# Altium schematic sheet R45_Driver.SchDoc
size A3; SheetNumber: 1; SheetTotal: 2
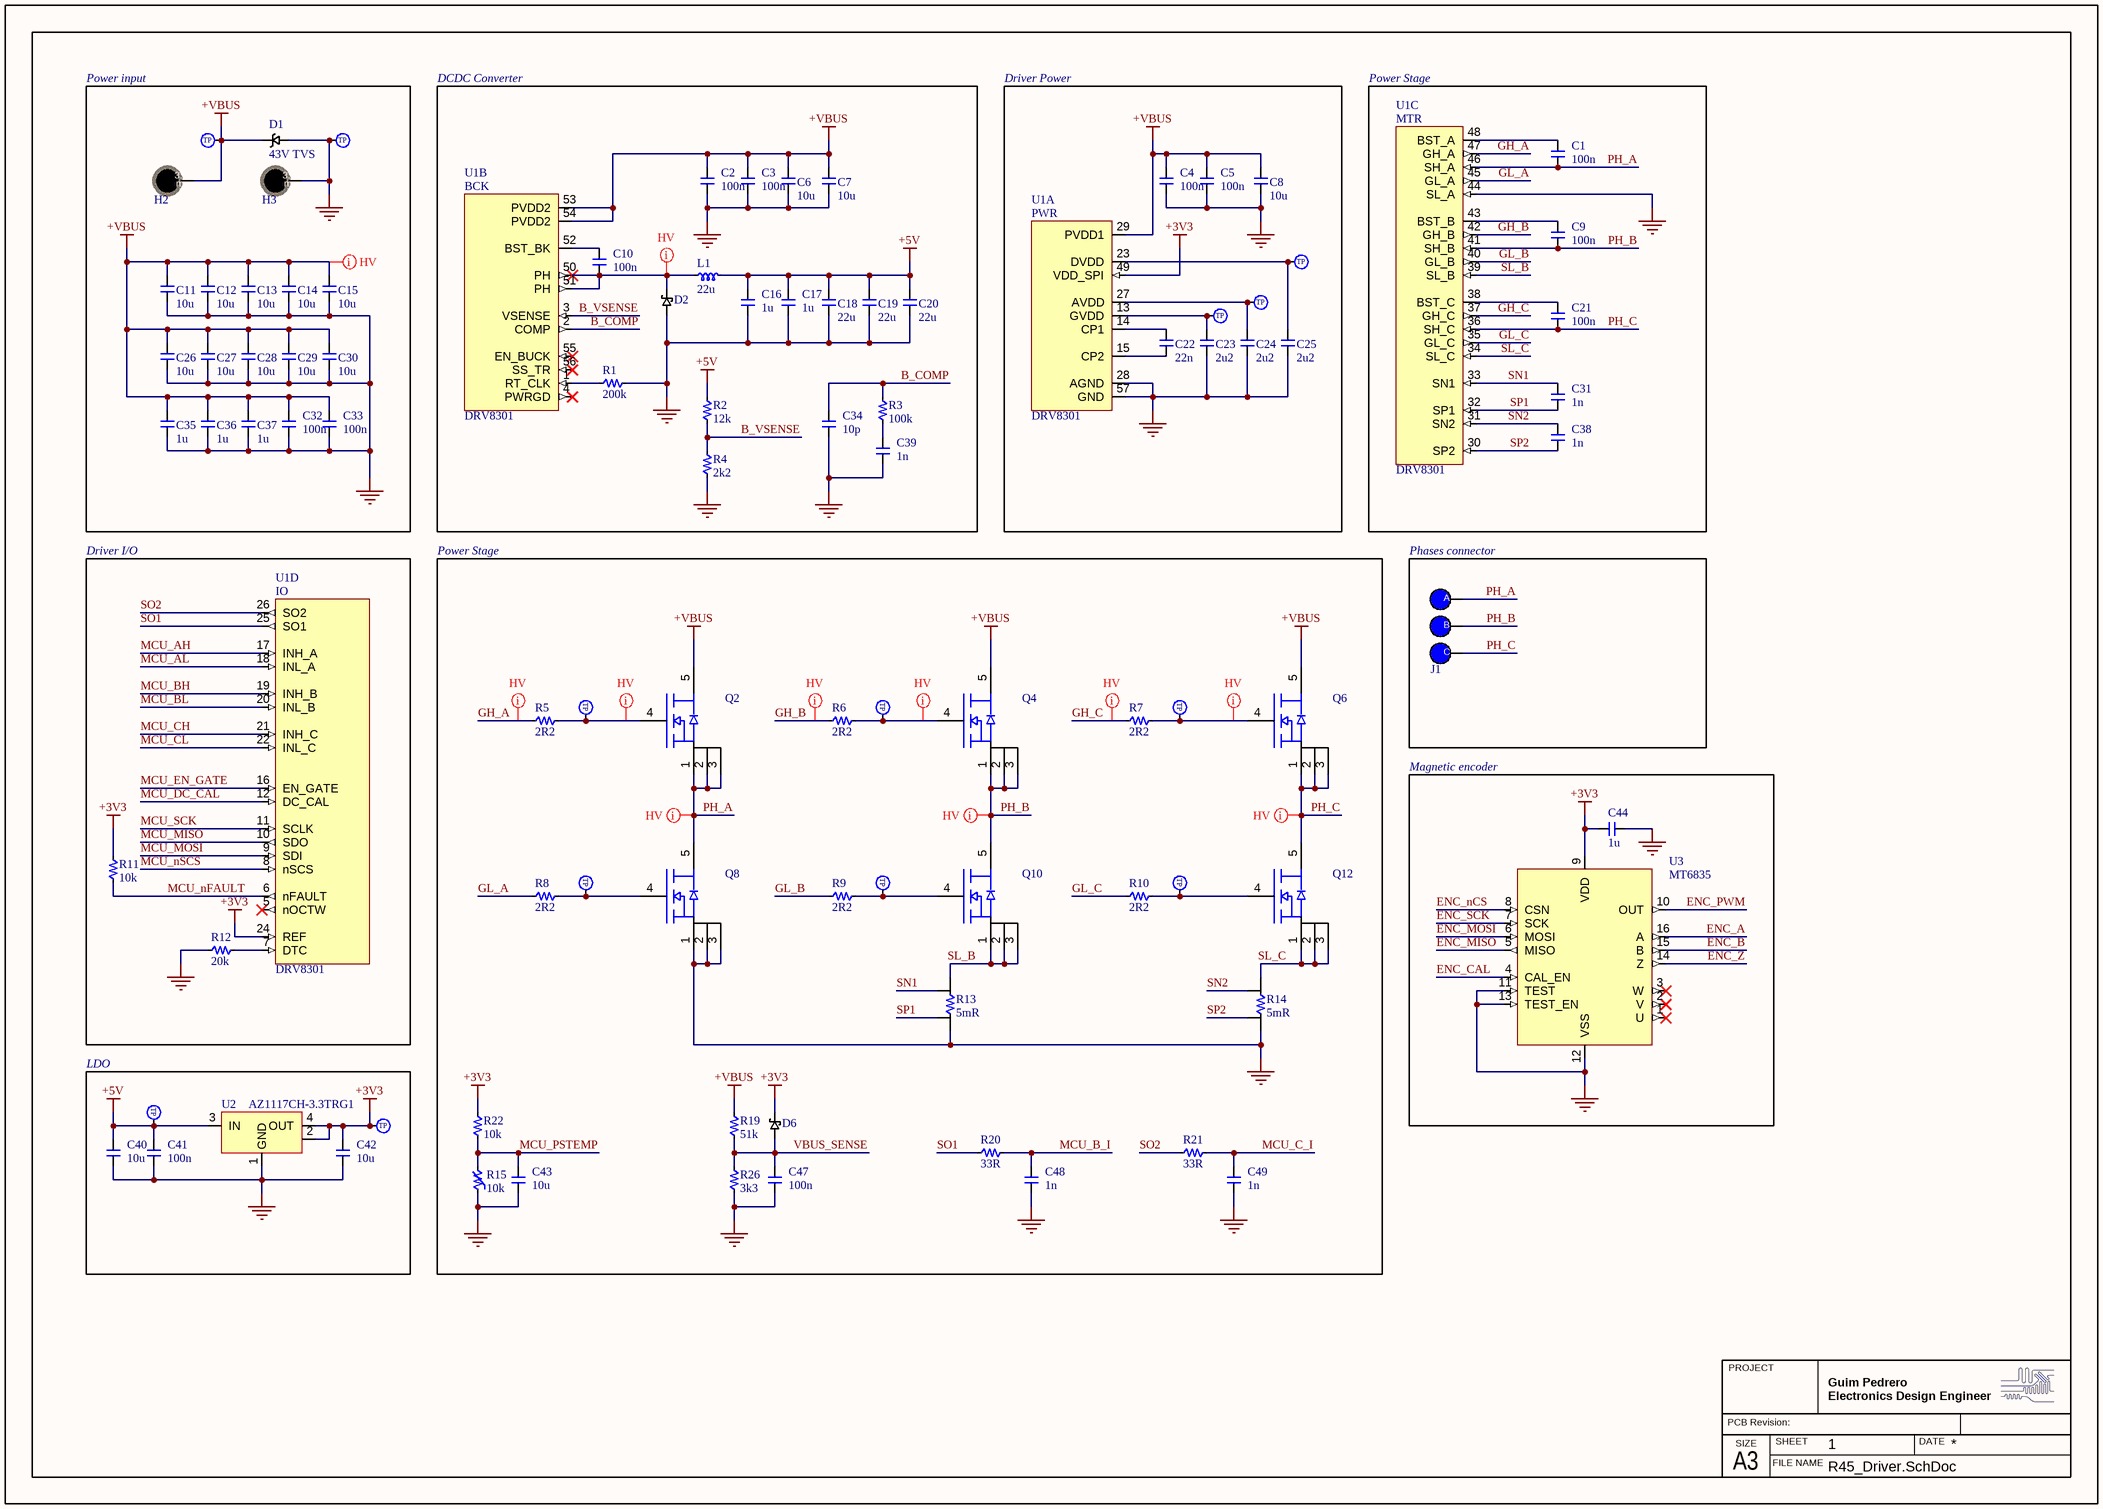
[diagram p0: R45_Driver.SchDoc]

## Parts
C1  100n  [C0402]
C2  100n  [C0402]
C3  100n  [C0402]
C4  100n  [C0402]
C5  100n  [C0402]
C6  10u  [C0805]
C7  10u  [C0805]
C8  10u  [C0805]
C9  100n  [C0402]
C10  100n  [C0402]
C11  10u  [C0805]
C12  10u  [C0805]
C13  10u  [C0805]
C14  10u  [C0805]
C15  10u  [C0805]
C16  1u  [C0402]
C17  1u  [C0402]
C18  22u  [C0805]
C19  22u  [C0805]
C20  22u  [C0805]
C21  100n  [C0402]
C22  22n  [C0402]
C23  2u2  [C0603]
C24  2u2  [C0603]
C25  2u2  [C0603]
C26  10u  [C0805]
C27  10u  [C0805]
C28  10u  [C0805]
C29  10u  [C0805]
C30  10u  [C0805]
C31  1n  [C0402]
C32  100n  [C0402]
C33  100n  [C0402]
C34  10p  [C0402]
C35  1u  [C0603]
C36  1u  [C0603]
C37  1u  [C0603]
C38  1n  [C0402]
C39  1n  [C0402]
C40  10u  [C0402]
C41  100n  [C0402]
C42  10u  [C0402]
C43  10u  [C0402]
C44  1u  [C0402]
C47  100n  [C0402]
C48  1n  [C0402]
C49  1n  [C0402]
D1  43V TVS  [P6SMB]
D2  1N5819WS  [SOD323]  (value not drawn)
D6  1N5819WS  [SOD323]  (value not drawn)
H2  (no value)  [Hole_3.2mm_Routing]  (no BOM)
H3  (no value)  [Hole_3.2mm_Routing]  (no BOM)
J1  R45_conn  [R45_connector]  (value not drawn)  (no BOM)
L1  22u  [L_SRN6045]
Q2  BSC0702LS  [PG-TDSON-8]  (value not drawn)
Q4  BSC0702LS  [PG-TDSON-8]  (value not drawn)
Q6  BSC0702LS  [PG-TDSON-8]  (value not drawn)
Q8  BSC0702LS  [PG-TDSON-8]  (value not drawn)
Q10  BSC0702LS  [PG-TDSON-8]  (value not drawn)
Q12  BSC0702LS  [PG-TDSON-8]  (value not drawn)
R1  200k  [R0402]
R2  12k  [R0402]
R3  100k  [R0402]
R4  2k2  [R0402]
R5  2R2  [R0402]
R6  2R2  [R0402]
R7  2R2  [R0402]
R8  2R2  [R0402]
R9  2R2  [R0402]
R10  2R2  [R0402]
R11  10k  [R0402]
R12  20k  [R0402]
R13  5mR  [R2512]
R14  5mR  [R2512]
R15  10k  [R0402]
R19  51k  [R0402]
R20  33R  [R0402]
R21  33R  [R0402]
R22  10k  [R0402]
R26  3k3  [R0402]
TP1  Testing_Point_1mm  [TestingPoint_1mm]  (value not drawn)  (no BOM)
TP2  Testing_Point_1mm  [TestingPoint_1mm]  (value not drawn)  (no BOM)
TP3  Testing_Point_1mm  [TestingPoint_1mm]  (value not drawn)  (no BOM)
TP4  Testing_Point_1mm  [TestingPoint_1mm]  (value not drawn)  (no BOM)
TP5  Testing_Point_1mm  [TestingPoint_1mm]  (value not drawn)  (no BOM)
TP6  Testing_Point_1mm  [TestingPoint_1mm]  (value not drawn)  (no BOM)
TP7  Testing_Point_1mm  [TestingPoint_1mm]  (value not drawn)  (no BOM)
TP8  Testing_Point_1mm  [TestingPoint_1mm]  (value not drawn)  (no BOM)
TP9  Testing_Point_1mm  [TestingPoint_1mm]  (value not drawn)  (no BOM)
TP10  Testing_Point_1mm  [TestingPoint_1mm]  (value not drawn)  (no BOM)
TP11  Testing_Point_1mm  [TestingPoint_1mm]  (value not drawn)  (no BOM)
TP12  Testing_Point_1mm  [TestingPoint_1mm]  (value not drawn)  (no BOM)
TP13  Testing_Point_1mm  [TestingPoint_1mm]  (value not drawn)  (no BOM)
U1  DRV8301  [DRV8301]  (parts A,B,C,D of 4)
U2  AZ1117CH-3.3TRG1  [AZ1117CH-3.3TRG1]
U3  MT6835  [TSOP65P640X120-16N]

## Blocks framed on the sheet
Power input: C11-C15 C26-C30 C32 C33 C35-C37 D1 H2 H3 TP1 TP2
DCDC Converter: C2 C3 C6 C7 C10 C16-C20 C34 C39 D2 L1 R1-R4 U1
Driver Power: C4 C5 C8 C22-C25 TP3-TP5 U1
Power Stage: C1 C9 C21 C31 C38 U1
Driver I/O: R11 R12 U1
Power Stage: C43 C47-C49 D6 Q2 Q4 Q6 Q8 Q10 Q12 R5-R10 R13-R15 R19-R22 R26 TP6-TP11
Phases connector: J1
Magnetic encoder: C44 U3
LDO: C40-C42 TP12 TP13 U2

## Nets
+3V3: C42.2 C44.2 D6.2 R11.2 R22.1 TP13.1 U1.24(REF) U1.49(VDD_SPI) U2.2(OUT) U2.4(OUT) U3.9(VDD)
+5V: C16.2 C17.2 C18.2 C19.2 C20.2 C40.2 C41.2 L1.2 R2.2 TP12.1 U2.3(IN)
+VBUS: C2.2 C3.2 C4.2 C5.2 C6.2 C7.2 C8.2 C11.2 C12.2 C13.2 C14.2 C15.2 C26.2 C27.2 C28.2 C29.2 C30.2 C32.2 C33.2 C35.2 C36.2 C37.2 D1.1 H2.1 Q2.5 Q4.5 Q6.5 R19.1 TP1.1 U1.29(PVDD1) U1.53(PVDD2) U1.54(PVDD2)
GND: C2.1 C3.1 C4.1 C5.1 C6.1 C7.1 C8.1 C11.1 C12.1 C13.1 C14.1 C15.1 C16.1 C17.1 C18.1 C19.1 C20.1 C23.1 C24.1 C25.1 C26.1 C27.1 C28.1 C29.1 C30.1 C32.1 C33.1 C34.1 C35.1 C36.1 C37.1 C39.1 C40.1 C41.1 C42.1 C43.1 C44.1 C47.1 C48.1 C49.1 D1.2 D2.1 H3.1 Q8.1 Q8.2 Q8.3 R1.2 R4.1 R12.1 R13.2 R14.2 R15.1 R26.2 TP2.1 U1.28(AGND) U1.44(SL_A) U1.57(GND) U2.1(GND) U3.11(TEST) U3.12(VSS) U3.13(TEST_EN)
B_COMP: C34.2 R3.1 U1.2(COMP)
B_VSENSE: R2.1 R4.2 U1.3(VSENSE)
ENC_A: U3.16(A)
ENC_B: U3.15(B)
ENC_CAL: U3.4(CAL_EN)
ENC_MISO: U3.5(MISO)
ENC_MOSI: U3.6(MOSI)
ENC_nCS: U3.8(CSN)
ENC_PWM: U3.10(OUT)
ENC_SCK: U3.7(SCK)
ENC_Z: U3.14(Z)
GH_A: R5.1 U1.47(GH_A)
GH_B: R6.1 U1.42(GH_B)
GH_C: R7.1 U1.37(GH_C)
GL_A: R8.1 U1.45(GL_A)
GL_B: R9.1 U1.40(GL_B)
GL_C: R10.1 U1.35(GL_C)
MCU_AH: U1.17(INH_A)
MCU_AL: U1.18(INL_A)
MCU_B_I: C48.2 R20.2
MCU_BH: U1.19(INH_B)
MCU_BL: U1.20(INL_B)
MCU_C_I: C49.2 R21.2
MCU_CH: U1.21(INH_C)
MCU_CL: U1.22(INL_C)
MCU_DC_CAL: U1.12(DC_CAL)
MCU_EN_GATE: U1.16(EN_GATE)
MCU_MISO: U1.10(SDO)
MCU_MOSI: U1.9(SDI)
MCU_nFAULT: R11.1 U1.6(nFAULT)
MCU_nSCS: U1.8(nSCS)
MCU_PSTEMP: C43.2 R15.2 R22.2
MCU_SCK: U1.11(SCLK)
PH_A: C1.1 J1.A Q2.1 Q2.2 Q2.3 Q8.5 U1.46(SH_A)
PH_B: C9.1 J1.B Q4.1 Q4.2 Q4.3 Q10.5 U1.41(SH_B)
PH_C: C21.1 J1.C Q6.1 Q6.2 Q6.3 Q12.5 U1.36(SH_C)
SL_B: Q10.1 Q10.2 Q10.3 R13.1 U1.39(SL_B)
SL_C: Q12.1 Q12.2 Q12.3 R14.1 U1.34(SL_C)
SN1: C31.2 R13.3 U1.33(SN1)
SN2: C38.2 R14.3 U1.31(SN2)
SO1: R20.1 U1.25(SO1)
SO2: R21.1 U1.26(SO2)
SP1: C31.1 R13.4 U1.32(SP1)
SP2: C38.1 R14.4 U1.30(SP2)
VBUS_SENSE: C47.2 D6.1 R19.2 R26.1
NetC1_2: C1.2 U1.48(BST_A)
NetC9_2: C9.2 U1.43(BST_B)
NetC10_1: C10.1 D2.2 L1.1 U1.50(PH) U1.51(PH)
NetC10_2: C10.2 U1.52(BST_BK)
NetC21_2: C21.2 U1.38(BST_C)
NetC22_1: C22.1 U1.15(CP2)
NetC22_2: C22.2 U1.14(CP1)
NetC23_2: C23.2 TP5.1 U1.13(GVDD)
NetC24_2: C24.2 TP4.1 U1.27(AVDD)
NetC25_2: C25.2 TP3.1 U1.23(DVDD)
NetC39_2: C39.2 R3.2
NetQ2_4: Q2.4 R5.2 TP6.1
NetQ4_4: Q4.4 R6.2 TP7.1
NetQ6_4: Q6.4 R7.2 TP8.1
NetQ8_4: Q8.4 R8.2 TP9.1
NetQ10_4: Q10.4 R9.2 TP10.1
NetQ12_4: Q12.4 R10.2 TP11.1
NetR1_1: R1.1 U1.1(RT_CLK)
NetR12_2: R12.2 U1.7(DTC)

Not connected (* = marked no-connect by the designer): U1 4(PWRGD)* 5(nOCTW)* 55(EN_BUCK)* 56(SS_TR)*; U3 1(U)* 2(V)* 3(W)*

## Layout directives
net class HV: +VBUS, GH_A, GH_B, GH_C, NetC10_1, NetQ2_4, NetQ4_4, NetQ6_4, PH_A, PH_B, PH_C

## Notes on the sheet
- PROJECT
- PCB Revision:
- SIZE
- FILE NAME
- SHEET
- Guim Pedrero
  Electronics Design Engineer
- DATE
- A3
- (in symbol DRV8301, part A) PWR
- (in symbol DRV8301, part B) BCK
- (in symbol DRV8301, part C) MTR
- (in symbol DRV8301, part D) IO
- (in symbol Hole_3.2mm_Routing) 3.2; mm
- (in symbol Testing_Point_1mm) TP

## Library data of the parts
C1-C5 C9 C10 C16 C17 C21 C22 C31-C34 C38-C44 C47-C49 = C_0402: 0402 cap
  C1-C5 C9 C10 C21 C32 C33 C41 C47: LCSC: C307331
  C16 C17 C44: LCSC: C52923
  C22: LCSC: C1532
  C31 C38 C39 C48 C49: LCSC: C1523
  C34: LCSC: C32949
  C40 C42 C43: LCSC: C15525
C6-C8 C11-C15 C18-C20 C26-C30 = C_0805: 0805 cap
  C6-C8 C11-C15 C26-C30: LCSC: C440198
  C18-C20: LCSC: C45783
C23-C25 C35-C37 = C_0603: 0603 cap
  C23-C25: LCSC: C23630
  C35-C37: LCSC: C15849
D1 = P6SMB43CA: LCSC: C20538993
D2 D6 = 1N5819WS: 40V 600mV@1A 1A SOD-323  Schottky; LCSC: C191023
H2 H3 = Hole_3.2mm_Routing: Mounting, plated hole, 3.2 mm diameter, AWG14
L1 = SWPA6045S220MT: 1.8A 22uH ±20% 2.2A SMD,6x6mm Power Inductors ROHS; LCSC: C83454
Q2 Q4 Q6 Q8 Q10 Q12 = BSC0702LS: 60V, 134A, 2.7mΩ N-FET; LCSC: C501503
R1-R12 R19-R22 R26 = R_0402: 0402 62.5mW
  R1: LCSC: C25764
  R2: LCSC: C25752
  R3: LCSC: C25741
  R4: LCSC: C25879
  R5-R10: LCSC: C25158
  R11 R22: LCSC: C25744
  R12: LCSC: C25765
  R19: LCSC: C25794
  R20 R21: LCSC: C25105
  R26: LCSC: C25890
R13 R14 = PA2512FKF7T0R005E: 3W ±100ppm/℃ ±1% 5mΩ 2512 Chip Resistor; LCSC: C728323
R15 = NCP15XH103F03RC: 10kΩ 310uA 100mW ±1% 3380K ±1% 0402 NTC Thermistors ROHS; LCSC: C77131
TP1-TP13 = Testing_Point_1mm: 1mm testing point
U1 = DRV8301: Brushless DC Motor Controller, 2.3A, PDSO56; Manufacturer: Texas Instruments; Manufacturer Part Number: DRV8301DCAR; Package Body Material: Plastic; Channels: 1; Package Equivalence Code: TSSOP56,.3,20; Power Supplies: 8/60V; Max Supply Voltage: 60V; Min Supply Voltage: 6V; Nominal Supply Voltage: 8V; Qualification Status: Not Qualified; LCSC: C98969; Supplier: Mouser; Supplier Part Number: 595-DRV8301DCAR; RoHS: Yes; Category: Gate Drivers; Stock: 5803; Pricing: 1=5.83, 10=4.13, 50=4.13, 100=3.75, 1000=3.38, 10000=3.29 (USD); Case/Package: HTSSOP; Pins: 56; Package Shape: Rectangular; Terminal Finish: Nickel; Min Operating Temperature: -40°C; Max Operating Temperature: 125°C; JESD-609 Code: e4; Throw Configuration: BRUSHLESS DC MOTOR CONTROLLER; JESD-30 Code: R-PDSO-G56; Moisture Sensitivity Level: 3; Max Output current: 2.3A; Package Style: SMALL OUTLINE, HEAT SINK/SLUG, THIN PROFILE, SHRINK PITCHMeter; Peak Reflow Temperature (Cel): 260°C; Surface Mount: Yes; Terminal Form: Gull Wing; Terminal Position: DUAL; Length: 14mm; Width: 6.1mm; Height - Seated (Max): 1.2mm; Terminal Pitch: 0.5mm; Temperature Grade: AUTOMOTIVE; Reach SVHC Compliant: Yes; RoHS Compliant: Yes; ComponentLink1URL: https://www.ti.com:443/lit/ds/symlink/drv8301.pdf?src-supplier=IHS+Markit; ComponentLink1Description: https://www.ti.com:443/lit/ds/symlink/drv8301.pdf?src-supplier=IHS+Markit; ComponentLink2URL: https://datasheet.ciiva.com/1958/drv8301-1958834.pdf?src-supplier=Digikey; ComponentLink2Description: https://datasheet.ciiva.com/1958/drv8301-1958834.pdf?src-supplier=Digikey; ComponentLink3URL: https://datasheet.ciiva.com/15109/getdatasheetpartid-375865-15109501.pdf?src-supplier=Verical; ComponentLink3Description: https://datasheet.ciiva.com/15109/getdatasheetpartid-375865-15109501.pdf?src-supplier=Verical; ComponentLink4URL: https://datasheet.ciiva.com/1500/1882248-1500551.pdf?src-supplier=Element14; ComponentLink4Description: https://datasheet.ciiva.com/1500/1882248-1500551.pdf?src-supplier=Element14; ComponentLink5URL: https://datasheet.ciiva.com/3228/drv8301-3228991.pdf?src-supplier=Avnet; ComponentLink5Description: https://datasheet.ciiva.com/3228/drv8301-3228991.pdf?src-supplier=Avnet; ComponentLink6URL: https://datasheet.ciiva.com/1958/drv8301-1958835.pdf?src-supplier=Digikey; ComponentLink6Description: https://datasheet.ciiva.com/1958/drv8301-1958835.pdf?src-supplier=Digikey; ComponentLink7URL: https://datasheet.ciiva.com/1958/drv8301-1958836.pdf?src-supplier=Digikey; ComponentLink7Description: https://datasheet.ciiva.com/1958/drv8301-1958836.pdf?src-supplier=Digikey
U2 = AZ1117CH-3.3TRG1: Fixed Positive LDO Regulator, 3.3V, 1.3V Dropout, BIPolar, PDSO3; Manufacturer: Diodes; Package Body Material: Plastic; Dropout Voltage1-Nom: 1.2V; Input Voltage Absolute-Max: 18V; Max Supply Voltage: 15V; Line Regulation-Max: 0.01%; Load Regulation-Max: 0.015%; Channels: 1; Output Current1-Max: 800mA; Output Voltage1-Max: 3.365V; Output Voltage1-Min: 3.235V; Regulator Type: FIXED POSITIVE SINGLE OUTPUT LDO REGULATOR; Voltage Tolerance-Max: 1.97%; Qualification Status: Not Qualified; Supplier 1: Future Electronics; Manufacturer Part Number: AZ1117CH-3.3TRG1; RoHS: Yes; Category: Voltage Regulators - Linear; Stock 1: 820000; Pricing 1: 4000=0.0702, 16000=0.0672, 40000=0.0653, 100000=0.0634, 160000=0.0607 (USD); Case/Package: SOP; Pins: 3; Package Shape: Rectangular; Terminal Finish: Tin; JESD-609 Code: e3; Adjustability: FIXED; Dropout Voltage1-Max: 1.3V; JESD-30 Code: R-PDSO-G3; Moisture Sensitivity Level: 1; Number of Outputs: 1; Operating Temperature, TJ-Max: 125°C; Operating Temperature, TJ-Min: -20°C; Output Voltage1-Nom: 3.3V; Package Style: SMALL OUTLINEMeter; Packaging: Tape and Reel; Surface Mount: Yes; Technology: BIPOLAR; Terminal Form: Gull Wing; Terminal Position: DUAL; Length: 6.5mm; Width: 3.5mm; Terminal Pitch: 2.3mm; Height - Seated (Max): 1.8mm; Reach SVHC Compliant: Yes; RoHS Compliant: Yes; ComponentLink1URL: https://datasheet.ciiva.com:443/pdfs/VipMasterIC/IC/DIOD/DIOD-S-A0007713706/DIOD-S-A0007713706-1.pdf?src-supplier=IHS+Markit; ComponentLink1Description: https://datasheet.ciiva.com:443/pdfs/VipMasterIC/IC/DIOD/DIOD-S-A0007713706/DIOD-S-A0007713706-1.pdf?src-supplier=IHS+Markit; ComponentLink2URL: https://datasheet.ciiva.com/29569/az1117c-29569914.pdf?src-supplier=Digi-Key; ComponentLink2Description: https://datasheet.ciiva.com/29569/az1117c-29569914.pdf?src-supplier=Digi-Key; ComponentLink3URL: https://datasheet.ciiva.com/29569/az1117c-29569915.pdf?src-supplier=Digi-Key; ComponentLink3Description: https://datasheet.ciiva.com/29569/az1117c-29569915.pdf?src-supplier=Digi-Key; ComponentLink4URL: https://datasheet.ciiva.com/29569/az1117c-29569913.pdf?src-supplier=Digi-Key; ComponentLink4Description: https://datasheet.ciiva.com/29569/az1117c-29569913.pdf?src-supplier=Digi-Key; Supplier Part Number 1: 6047233; LCSC: C92102
U3 = MT6835GT-STD: LCSC: C2932578